# EasyEDA schematic SCH_Project-SappY_2026-01-23.json
TITLE: Sheet_1; REV: 1.0; Date: 2026-01-22; Sheet: 1/1; Drawn By: itsmohammadsarfaraz; Company: Your Company
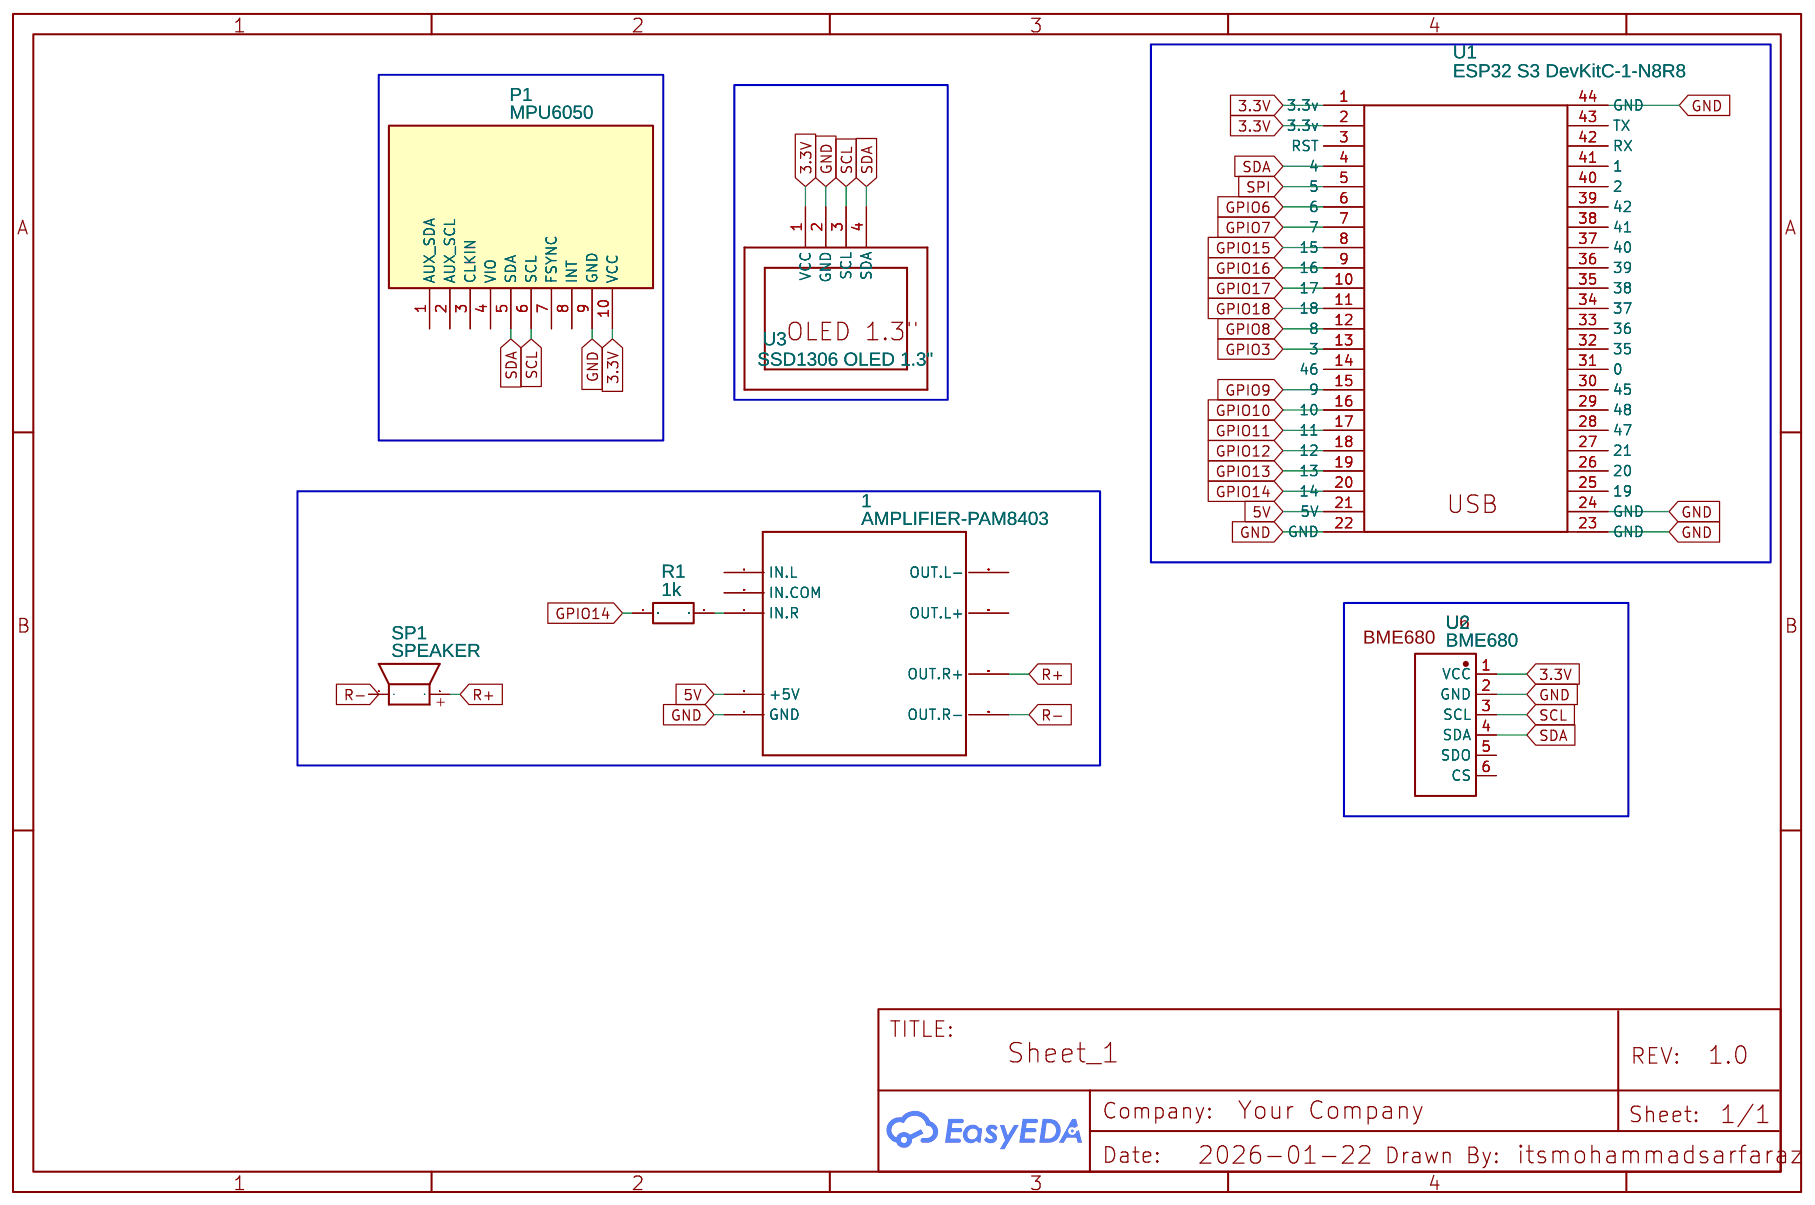
[diagram p0: schematic sheet]

## Parts
1  AMPLIFIER-PAM8403  [AMPLIFIER-PAM8403]
P1  MPU6050  [MPU6050]
R1  1k  [R0603]
SP1  SPEAKER  [SPEAKER]
U1  ESP32 S3 DevKitC-1-N8R8  [ESP32 S3 DEVELOPMENT BOARD ESP32-S3-DEVKITC-1-N8R8]
U2  BME680  [BME680]
U3  SSD1306 OLED 1.3"  [SSD1306_1.3"OLED]

## Library data of the parts
1 = AMPLIFIER-PAM8403: Contributor: Michael Patricelli
P1 = MPU6050: sourceId: 1T5FDZYC8; Contributor: AsthmaMan
R1 = R_0603_EU: Contributor: LCEDA_Lib
SP1 = SPEAKER: Código: PK-12N40PEQ; Fabricante: Unicoba&Mallory; Encapsulamento: *; Identificação: *; Observação: *; Código Estoque: 010332; Preço 1KPC: *; Preço 1PC: *; Contributor: doomscar
U1 = ESP32 S3 DevKitC-1-N8R8: link: https://www.amazon.com/gp/product/B0D93F8BHJ/ref=sw_img_1?smid=A3VN3QAHGNRFWG&psc=1; Contributor: ti47
U2 = BME680: Supplier: RS-Online; Contributor: dwipanjan
U3 = SSD1306 OLED 1.3": Contributor: PSA38

## Nets
3.3V: P1.10(VCC) U1.1(3.3v) U1.2(3.3v) U2.1(VCC) U3.1(VCC)
5V: 1.+5V U1.21(5V)
GND: 1.GND P1.9(GND) U1.22(GND) U1.24(GND) U1.44(GND) U2.2(GND) U3.2(GND)
GPIO3: U1.13(3)
GPIO6: U1.6
GPIO7: U1.7
GPIO8: U1.12(8)
GPIO9: U1.15(9)
GPIO10: U1.16(10)
GPIO11: U1.17(11)
GPIO12: U1.18(12)
GPIO13: U1.19(13)
GPIO14: R1.1 U1.20(14)
GPIO15: U1.8(15)
GPIO16: U1.9(16)
GPIO17: U1.10(17)
GPIO18: U1.11(18)
R+: 1.OUT.R+ SP1.1(+)
R-: 1.OUT.R- SP1.2(-)
SCL: P1.6(SCL) U2.3(SCL) U3.3(SCL)
SDA: P1.5(SDA) U1.4 U2.4(SDA) U3.4(SDA)
SPI: U1.5
Net-(1-IN.R): 1.IN.R R1.2

Not connected (* = marked no-connect by the designer): 1 IN.COM IN.L OUT.L+ OUT.L-; P1 1(AUX_SDA) 2(AUX_SCL) 3(CLKIN) 4(VIO) 7(FSYNC) 8(INT); U1 3(RST) 14(46) 23(GND) 25(19) 26(20) 27(21) 28(47) 29(48) 30(45) 31(0) 32(35) 33(36) 34(37) 35(38) 36(39) 37(40) 38(41) 39(42) 40(2) 41(1) 42(RX) 43(TX); U2 5(SDO) 6(CS)
